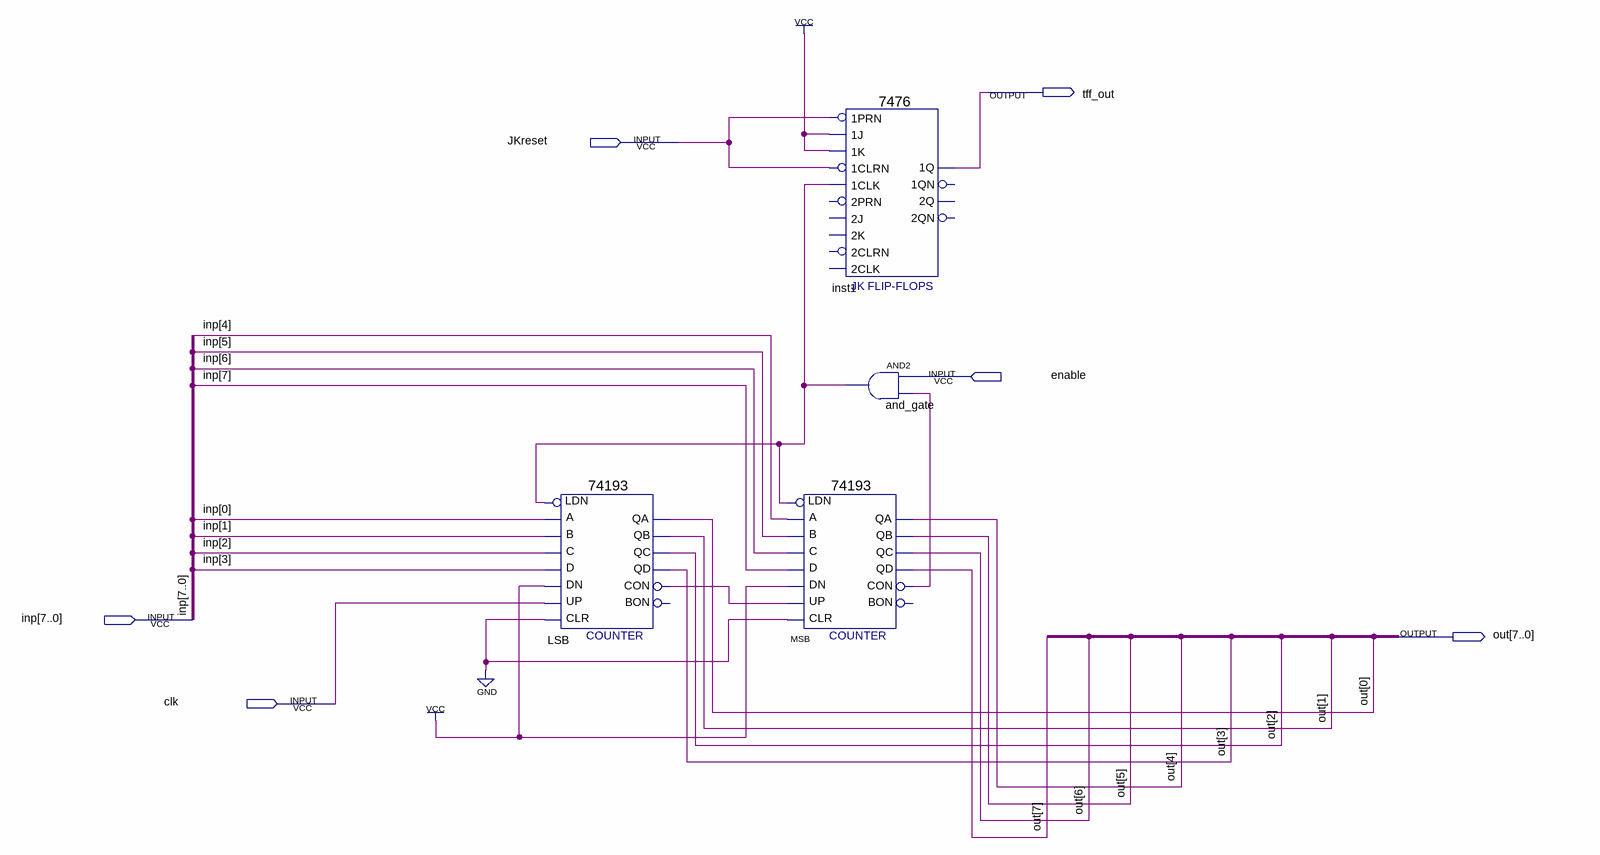
[diagram p0: schematic sheet]
// Quartus schematic clock_divider.bdf as structural Verilog: 4 symbols, 6 pins
module clock_divider (
  input  JKreset,
  input  enable,
  input  [7:0] inp,
  input  clk,
  output tff_out,
  output [7:0] out
);

  wire and_gate_out, LSB_con, MSB_con;

  \74193  LSB (
    .D(inp[3]), .C(inp[2]), .B(inp[1]), .A(inp[0]), .CLR(1'b0), .UP(clk), .DN(1'b1), .LDN(and_gate_out),
    .QB(out[1]), .QA(out[0]), .CON(LSB_con), .QD(out[3]), .QC(out[2]));  // open: BON
  \74193  MSB (
    .D(inp[7]), .C(inp[6]), .B(inp[5]), .A(inp[4]), .CLR(1'b0), .UP(LSB_con), .DN(1'b1), .LDN(and_gate_out),
    .QB(out[5]), .QA(out[4]), .CON(MSB_con), .QD(out[7]), .QC(out[6]));  // open: BON
  \7476  inst1 (
    .\1J (1'b1), .\1K (1'b1), .\1PRN (JKreset), .\1CLK (and_gate_out), .\1CLRN (JKreset), .\1Q (tff_out));  // open: 2PRN, 2J, 2K, 2CLRN, 2CLK, 2QN, 2Q, 1QN
  and and_gate (and_gate_out, enable, MSB_con);
endmodule
